# Altium schematic sheet schematic.SchDoc
size A4; SheetNumber: 1; SheetTotal: 1
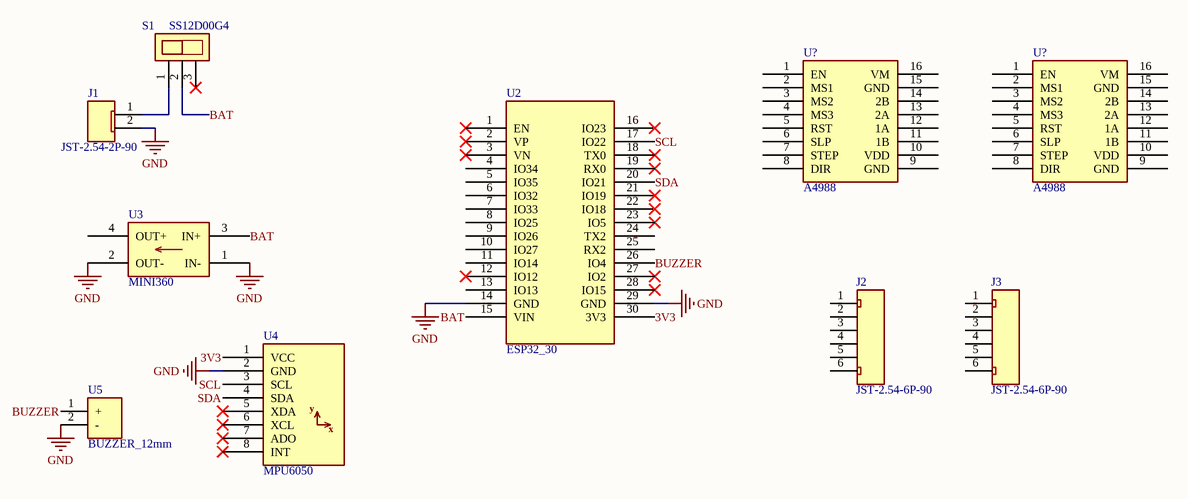
[diagram p0: schematic.SchDoc]

## Parts
(Parts that share a designator on the sheet are numbered #1, #2 ... from top to bottom, then left to right.)
J1  JST-2.54-2P-90  [JST-2.54-2P-90]
J2  JST-2.54-6P-90  [JST-2.54-6P-90]
J3  JST-2.54-6P-90  [JST-2.54-6P-90]
S1  SS12D00G4  [SS12D00G4]
U2  ESP32_30  [ESP32_30]
U3  MINI360  [MINI360]
U4  MPU6050  [MPU6050]
U5  BUZZER_12mm  [BUZZER_12mm]
U?#1  A4988  [A4988]
U?#2  A4988  [A4988]

## Nets
GND: J1.2 U2.14(GND) U2.29(GND) U3.1(IN-) U3.2(OUT-) U4.2(GND) U5.2(-)
3V3: U2.30(3V3) U4.1(VCC)
BAT: S1.2 U2.15(VIN) U3.3(IN+)
BUZZER: U2.26(IO4) U5.1(+)
SCL: U2.17(IO22) U4.3(SCL)
SDA: U2.20(IO21) U4.4(SDA)
NetJ1_1: J1.1 S1.1

Not connected (* = marked no-connect by the designer): J2 1 2 3 4 5 6; J3 1 2 3 4 5 6; S1 3*; U2 1(EN)* 2(VP)* 3(VN)* 4(IO34) 5(IO35) 6(IO32) 7(IO33) 8(IO25) 9(IO26) 10(IO27) 11(IO14) 12(IO12)* 13(IO13) 16(IO23)* 18(TX0)* 19(RX0)* 21(IO19)* 22(IO18)* 23(IO5)* 24(TX2) 25(RX2) 27(IO2)* 28(IO15)*; U3 4(OUT+); U4 5(XDA)* 6(XCL)* 7(ADO)* 8(INT)*; U?#1 1(EN) 2(MS1) 3(MS2) 4(MS3) 5(RST) 6(SLP) 7(STEP) 8(DIR) 9(GND) 10(VDD) 11(1B) 12(1A) 13(2A) 14(2B) 15(GND) 16(VM); U?#2 1(EN) 2(MS1) 3(MS2) 4(MS3) 5(RST) 6(SLP) 7(STEP) 8(DIR) 9(GND) 10(VDD) 11(1B) 12(1A) 13(2A) 14(2B) 15(GND) 16(VM)

## Notes on the sheet
- (in symbol MPU6050) y; x

## Library data of the parts
J1 = JST-2.54-2P-90: Female Connector JST 2 Vias, 2.54mm 90º.
J2 J3 = JST-2.54-6P-90: Female Connector JST 6 Vias, 2.54mm 90º.
U2 = ESP32_30: Microcontoller Board 30 Pins Wifi 2.4GHz BLE 4.2 ESP32-WROOM-32D; ComponentLink1Description: Datasheet; ComponentLink1URL: https://www.mouser.com/datasheet/2/891/esp32_wroom_32d_esp32_wroom_32u_datasheet_en-1365844.pdf
U3 = MINI360: MODULE BUCK STEP DOWN 3A 18x12mm; ComponentLink1Description: Datasheet; ComponentLink1URL: https://cdn-shop.adafruit.com/datasheets/MP2307_r1.9.pdf
U4 = MPU6050: IMU ACCEL/GYRO 3-AXIS I2C; ComponentLink1Description: Datasheet; ComponentLink1URL: https://invensense.tdk.com/wp-content/uploads/2015/02/MPU-6000-Datasheet1.pdf
U5 = BUZZER_12mm: BUZZER MAGNETIC 12MM; Digikey PN: 433-WT-1209T-ND; Mouser PN: 433-WT-1209T-ND
U?#1 U?#2 = A4988: Module Stepper Motor Driver 8-35V 2A 20x15mm; ComponentLink1Description: Datasheet; ComponentLink1URL: https://www.pololu.com/file/0J450/a4988_DMOS_microstepping_driver_with_translator.pdf